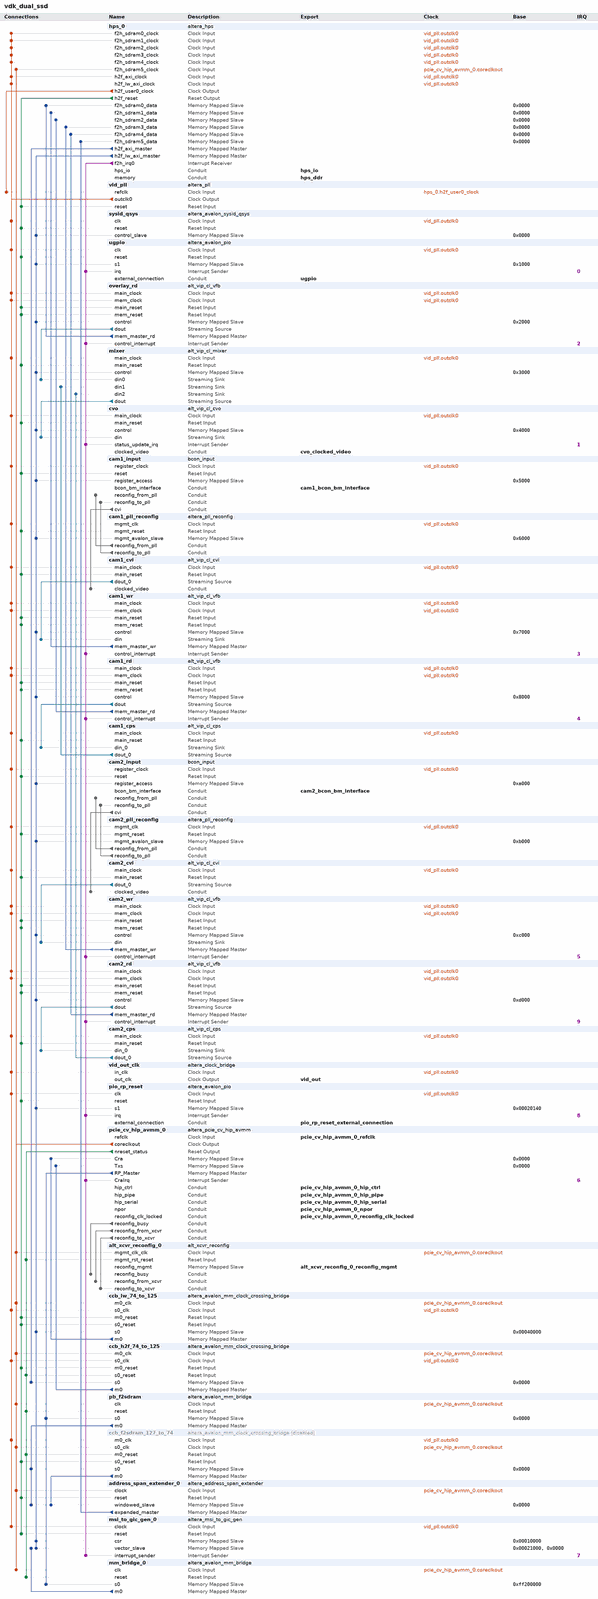
[diagram p0: system contents, whole]
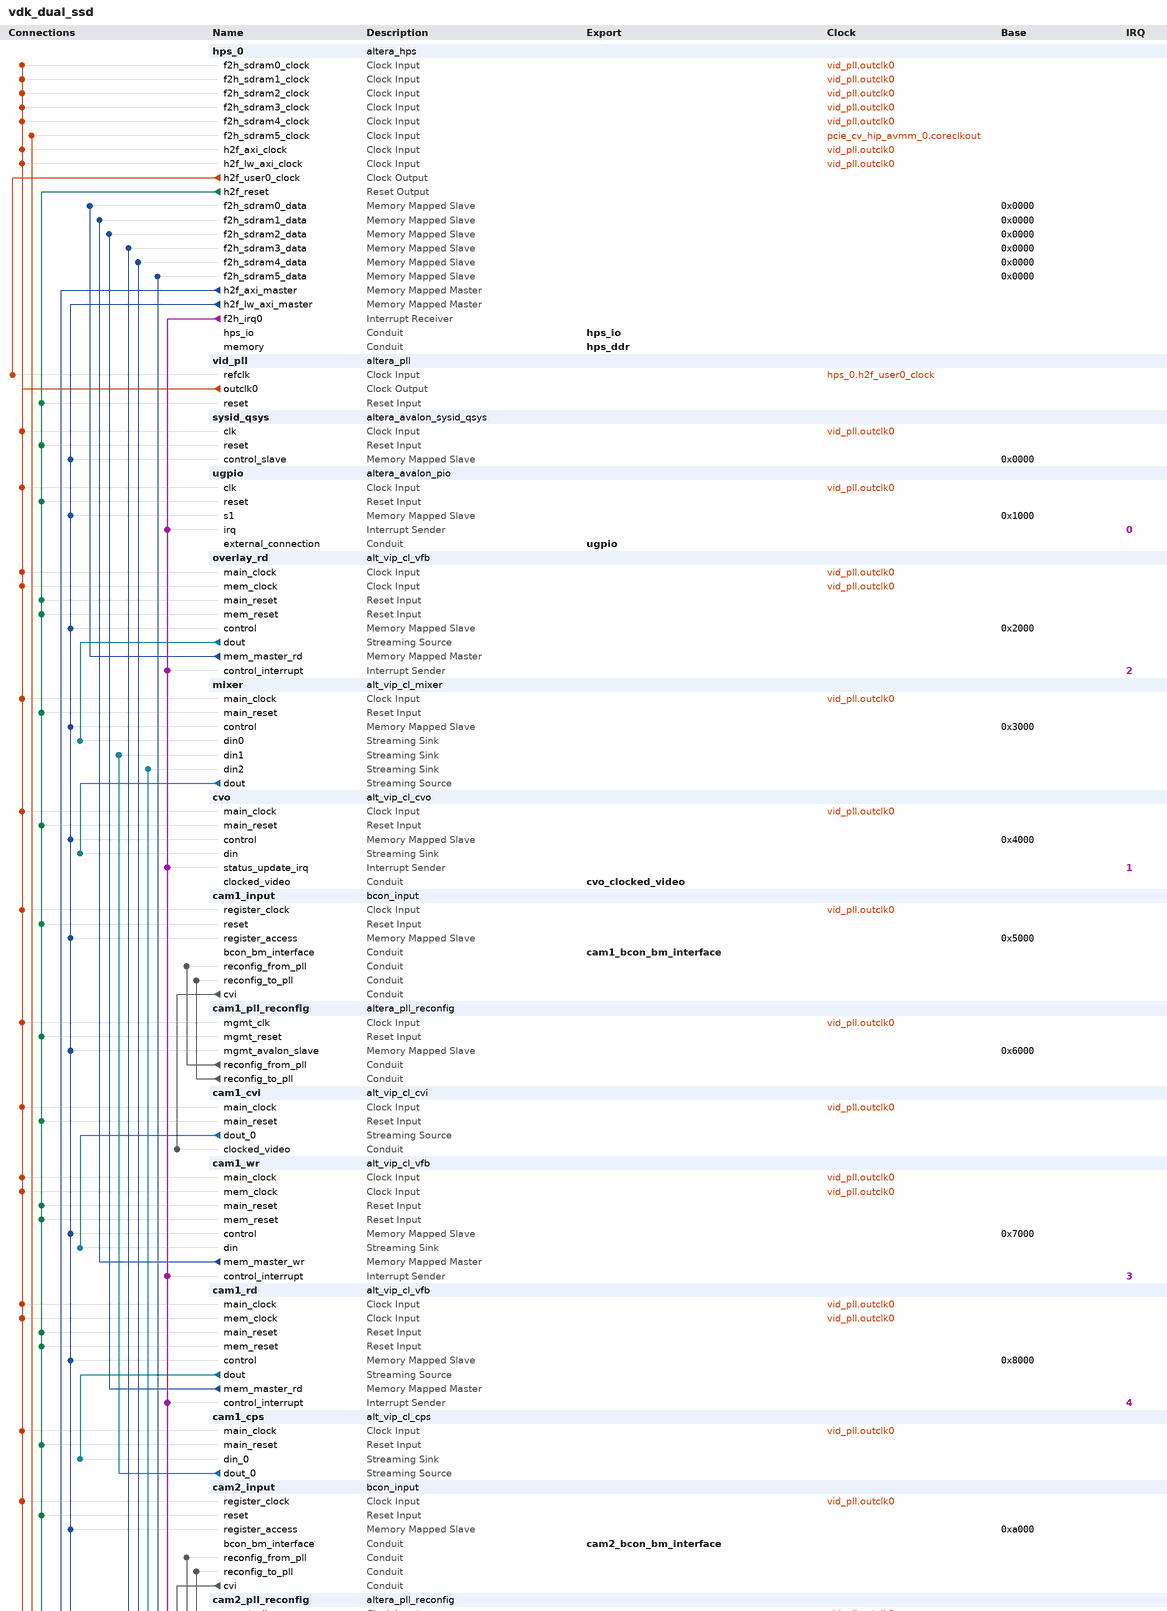
[diagram p1: system contents, upper part]
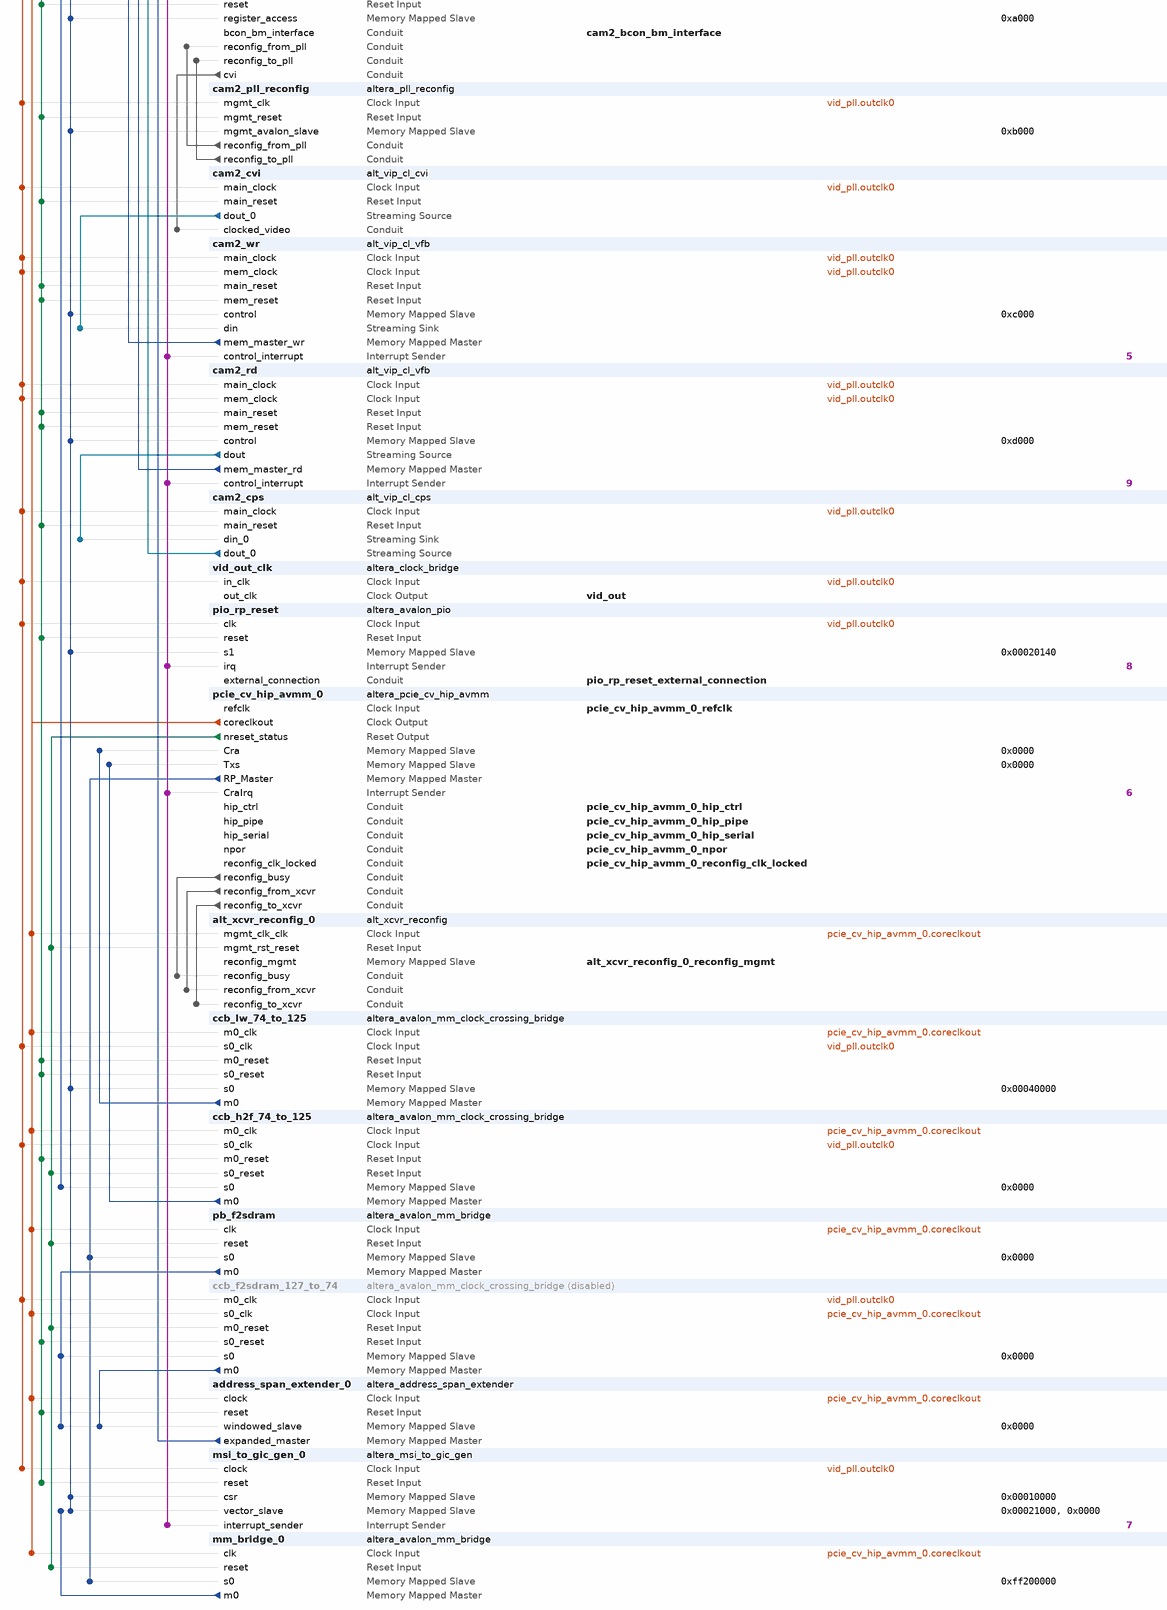
[diagram p2: system contents, lower part]
# Platform Designer (Qsys) system vdk_dual_ssd, Cyclone V 5CSXFC6C6U23C7
# Parameters at their usual value, and those the tool derives, are not listed.
package require -exact qsys 17.0
create_system vdk_dual_ssd
set_project_property DEVICE_FAMILY {Cyclone V}
set_project_property DEVICE 5CSXFC6C6U23C7

add_instance hps_0 altera_hps 17.0
set_instance_parameter_value hps_0 EMAC1_Mode RGMII
set_instance_parameter_value hps_0 EMAC1_PinMuxing {HPS I/O Set 0}
set_instance_parameter_value hps_0 F2SCLK_COLDRST_Enable false
set_instance_parameter_value hps_0 F2SCLK_DBGRST_Enable false
set_instance_parameter_value hps_0 F2SCLK_WARMRST_Enable false
set_instance_parameter_value hps_0 F2SDRAM_Type {Avalon-MM Read-Only,Avalon-MM Write-Only,Avalon-MM Read-Only,Avalon-MM Write-Only,Avalon-MM Read-Only,Avalon-MM Bidirectional}
set_instance_parameter_value hps_0 F2SDRAM_Width 64,64,64,64,64,64
set_instance_parameter_value hps_0 F2SINTERRUPT_Enable true
set_instance_parameter_value hps_0 F2S_Width 0
set_instance_parameter_value hps_0 FPGA_PERIPHERAL_OUTPUT_CLOCK_FREQ_EMAC0_GTX_CLK 100
set_instance_parameter_value hps_0 FPGA_PERIPHERAL_OUTPUT_CLOCK_FREQ_EMAC0_MD_CLK 100.0
set_instance_parameter_value hps_0 FPGA_PERIPHERAL_OUTPUT_CLOCK_FREQ_EMAC1_GTX_CLK 100
set_instance_parameter_value hps_0 FPGA_PERIPHERAL_OUTPUT_CLOCK_FREQ_EMAC1_MD_CLK 100.0
set_instance_parameter_value hps_0 HPS_PROTOCOL DDR3
set_instance_parameter_value hps_0 I2C0_Mode I2C
set_instance_parameter_value hps_0 I2C0_PinMuxing {HPS I/O Set 1}
set_instance_parameter_value hps_0 I2C1_Mode I2C
set_instance_parameter_value hps_0 I2C1_PinMuxing {HPS I/O Set 0}
set_instance_parameter_value hps_0 LWH2F_Enable true
set_instance_parameter_value hps_0 MEM_ASR Automatic
set_instance_parameter_value hps_0 MEM_BANKADDR_WIDTH 3
set_instance_parameter_value hps_0 MEM_CLK_FREQ 400.0
set_instance_parameter_value hps_0 MEM_COL_ADDR_WIDTH 10
set_instance_parameter_value hps_0 MEM_DQ_WIDTH 40
set_instance_parameter_value hps_0 MEM_DRV_STR RZQ/7
set_instance_parameter_value hps_0 MEM_ROW_ADDR_WIDTH 15
set_instance_parameter_value hps_0 MEM_RTT_NOM RZQ/4
set_instance_parameter_value hps_0 MEM_RTT_WR {Dynamic ODT off}
set_instance_parameter_value hps_0 MEM_TCL 7
set_instance_parameter_value hps_0 MEM_TFAW_NS 30.0
set_instance_parameter_value hps_0 MEM_TRAS_NS 35.0
set_instance_parameter_value hps_0 MEM_TRCD_NS 13.75
set_instance_parameter_value hps_0 MEM_TRFC_NS 260.0
set_instance_parameter_value hps_0 MEM_TRP_NS 13.75
set_instance_parameter_value hps_0 MEM_TRRD_NS 10.0
set_instance_parameter_value hps_0 MEM_TRTP_NS 10.0
set_instance_parameter_value hps_0 MEM_VENDOR JEDEC
set_instance_parameter_value hps_0 MEM_VOLTAGE {1.35V DDR3L}
set_instance_parameter_value hps_0 MEM_WTCL 6
set_instance_parameter_value hps_0 QSPI_Mode {2 SS}
set_instance_parameter_value hps_0 QSPI_PinMuxing {HPS I/O Set 1}
set_instance_parameter_value hps_0 REF_CLK_FREQ 25.0
set_instance_parameter_value hps_0 S2FCLK_USER0CLK_Enable true
set_instance_parameter_value hps_0 S2FCLK_USER2CLK 5
set_instance_parameter_value hps_0 S2F_Width 2
set_instance_parameter_value hps_0 SDIO_Mode {4-bit Data}
set_instance_parameter_value hps_0 SDIO_PinMuxing {HPS I/O Set 0}
set_instance_parameter_value hps_0 SPIM1_Mode N/A
set_instance_parameter_value hps_0 SPIM1_PinMuxing Unused
set_instance_parameter_value hps_0 STM_Enable false
set_instance_parameter_value hps_0 TIMING_BOARD_AC_SKEW 0.0
set_instance_parameter_value hps_0 TIMING_BOARD_AC_TO_CK_SKEW 0.0
set_instance_parameter_value hps_0 TIMING_BOARD_DQ_TO_DQS_SKEW 0.0
set_instance_parameter_value hps_0 TIMING_BOARD_MAX_CK_DELAY 0.6
set_instance_parameter_value hps_0 TIMING_BOARD_MAX_DQS_DELAY 0.2
set_instance_parameter_value hps_0 TIMING_BOARD_SKEW_BETWEEN_DQS 0.01
set_instance_parameter_value hps_0 TIMING_BOARD_SKEW_CKDQS_DIMM_MAX 0.215
set_instance_parameter_value hps_0 TIMING_BOARD_SKEW_CKDQS_DIMM_MIN 0.092
set_instance_parameter_value hps_0 TIMING_BOARD_SKEW_WITHIN_DQS 0.0
set_instance_parameter_value hps_0 TIMING_TDH 45
set_instance_parameter_value hps_0 TIMING_TDQSCK 225
set_instance_parameter_value hps_0 TIMING_TDQSQ 100
set_instance_parameter_value hps_0 TIMING_TDQSS 0.27
set_instance_parameter_value hps_0 TIMING_TDS 10
set_instance_parameter_value hps_0 TIMING_TDSH 0.18
set_instance_parameter_value hps_0 TIMING_TDSS 0.18
set_instance_parameter_value hps_0 TIMING_TIH 120
set_instance_parameter_value hps_0 TIMING_TIS 170
set_instance_parameter_value hps_0 TIMING_TQSH 0.4
set_instance_parameter_value hps_0 UART0_Mode {No Flow Control}
set_instance_parameter_value hps_0 UART0_PinMuxing {HPS I/O Set 2}
set_instance_parameter_value hps_0 USB1_Mode SDR
set_instance_parameter_value hps_0 USB1_PinMuxing {HPS I/O Set 0}
set_instance_parameter_value hps_0 desired_cfg_clk_mhz 100.0
set_instance_parameter_value hps_0 desired_qspi_clk_mhz 400.0

add_instance vid_pll altera_pll 17.0
set_instance_parameter_value vid_pll gui_device_speed_grade 2
set_instance_parameter_value vid_pll gui_number_of_clocks 1
set_instance_parameter_value vid_pll gui_operation_mode direct
set_instance_parameter_value vid_pll gui_output_clock_frequency0 74.25
set_instance_parameter_value vid_pll gui_pll_mode {Integer-N PLL}
set_instance_parameter_value vid_pll gui_reference_clock_frequency 100.0
set_instance_parameter_value vid_pll gui_use_locked false

add_instance sysid_qsys altera_avalon_sysid_qsys 17.0
set_instance_parameter_value sysid_qsys id 65536

add_instance ugpio altera_avalon_pio 17.0
set_instance_parameter_value ugpio bitClearingEdgeCapReg true
set_instance_parameter_value ugpio bitModifyingOutReg true
set_instance_parameter_value ugpio captureEdge true
set_instance_parameter_value ugpio direction Bidir
set_instance_parameter_value ugpio generateIRQ true
set_instance_parameter_value ugpio irqType EDGE
set_instance_parameter_value ugpio width 7

add_instance overlay_rd alt_vip_cl_vfb 17.0
set_instance_parameter_value overlay_rd CLOCKS_ARE_SEPARATE 1
set_instance_parameter_value overlay_rd DROP_FRAMES 1
set_instance_parameter_value overlay_rd DROP_INVALID_FIELDS 1
set_instance_parameter_value overlay_rd DROP_REPEAT_USER 0
set_instance_parameter_value overlay_rd IS_FRAME_READER 1
set_instance_parameter_value overlay_rd MAX_HEIGHT 720
set_instance_parameter_value overlay_rd MAX_WIDTH 1280
set_instance_parameter_value overlay_rd MEM_BASE_ADDR 536870912
set_instance_parameter_value overlay_rd MEM_BUFFER_OFFSET 16777216
set_instance_parameter_value overlay_rd MEM_PORT_WIDTH 64
set_instance_parameter_value overlay_rd READER_RUNTIME_CONTROL 1
set_instance_parameter_value overlay_rd READ_FIFO_DEPTH 64
set_instance_parameter_value overlay_rd USER_PACKETS_MAX_STORAGE 0
set_instance_parameter_value overlay_rd USE_BUFFER_OFFSET 0
set_instance_parameter_value overlay_rd WRITE_BURST_TARGET 32
set_instance_parameter_value overlay_rd WRITE_FIFO_DEPTH 64

add_instance mixer alt_vip_cl_mixer 17.0
set_instance_parameter_value mixer ALPHA_ENABLE 1
set_instance_parameter_value mixer ALPHA_STREAMS_ENABLE 0
set_instance_parameter_value mixer BITS_PER_SYMBOL 8
set_instance_parameter_value mixer COLOR_PLANES_ARE_IN_PARALLEL 1
set_instance_parameter_value mixer COLOR_SPACE RGB
set_instance_parameter_value mixer FAMILY {Cyclone V}
set_instance_parameter_value mixer IS_422 1
set_instance_parameter_value mixer LAYER_POSITION_ENABLE 1
set_instance_parameter_value mixer MAX_HEIGHT 720
set_instance_parameter_value mixer MAX_WIDTH 1280
set_instance_parameter_value mixer NO_OF_INPUTS 3
set_instance_parameter_value mixer NUMBER_OF_COLOR_PLANES 2
set_instance_parameter_value mixer PATTERN uniform
set_instance_parameter_value mixer PIPELINE_READY 0
set_instance_parameter_value mixer PIXELS_IN_PARALLEL 1
set_instance_parameter_value mixer UNIFORM_VALUE_BCR 0
set_instance_parameter_value mixer UNIFORM_VALUE_GCB 0
set_instance_parameter_value mixer UNIFORM_VALUE_RY 255
set_instance_parameter_value mixer USER_PACKET_FIFO_DEPTH 0
set_instance_parameter_value mixer USER_PACKET_SUPPORT DISCARD

add_instance cvo alt_vip_cl_cvo 17.0
set_instance_parameter_value cvo ACCEPT_COLOURS_IN_SEQ 0
set_instance_parameter_value cvo ANC_LINE 0
set_instance_parameter_value cvo AP_LINE 0
set_instance_parameter_value cvo BPS 8
set_instance_parameter_value cvo CLOCKS_ARE_SAME 1
set_instance_parameter_value cvo COLOUR_PLANES_ARE_IN_PARALLEL 1
set_instance_parameter_value cvo CONTEXT_WIDTH 8
set_instance_parameter_value cvo DST_WIDTH 8
set_instance_parameter_value cvo FIELD0_ANC_LINE 0
set_instance_parameter_value cvo FIELD0_V_BACK_PORCH 0
set_instance_parameter_value cvo FIELD0_V_BLANK 0
set_instance_parameter_value cvo FIELD0_V_FRONT_PORCH 0
set_instance_parameter_value cvo FIELD0_V_RISING_EDGE 0
set_instance_parameter_value cvo FIELD0_V_SYNC_LENGTH 0
set_instance_parameter_value cvo FIFO_DEPTH 1280
set_instance_parameter_value cvo F_FALLING_EDGE 0
set_instance_parameter_value cvo F_RISING_EDGE 0
set_instance_parameter_value cvo GENERATE_SYNC 0
set_instance_parameter_value cvo H_ACTIVE_PIXELS 1280
set_instance_parameter_value cvo H_BACK_PORCH 148
set_instance_parameter_value cvo H_BLANK 0
set_instance_parameter_value cvo H_FRONT_PORCH 88
set_instance_parameter_value cvo H_SYNC_LENGTH 44
set_instance_parameter_value cvo INTERLACED 0
set_instance_parameter_value cvo LOW_LATENCY 0
set_instance_parameter_value cvo NO_OF_CHANNELS 1
set_instance_parameter_value cvo NO_OF_MODES 1
set_instance_parameter_value cvo NUMBER_OF_COLOUR_PLANES 3
set_instance_parameter_value cvo PIXELS_IN_PARALLEL 1
set_instance_parameter_value cvo SRC_WIDTH 8
set_instance_parameter_value cvo STD_WIDTH 1
set_instance_parameter_value cvo TASK_WIDTH 8
set_instance_parameter_value cvo THRESHOLD 1279
set_instance_parameter_value cvo USE_CONTROL 1
set_instance_parameter_value cvo USE_EMBEDDED_SYNCS 0
set_instance_parameter_value cvo V_ACTIVE_LINES 720
set_instance_parameter_value cvo V_BACK_PORCH 36
set_instance_parameter_value cvo V_BLANK 0
set_instance_parameter_value cvo V_FRONT_PORCH 4
set_instance_parameter_value cvo V_SYNC_LENGTH 5

add_instance cam1_input bcon_input 1.1
set_instance_parameter_value cam1_input g_lane_invert 31
set_instance_parameter_value cam1_input g_vid_data_length 8

add_instance cam1_pll_reconfig altera_pll_reconfig 17.0

add_instance cam1_cvi alt_vip_cl_cvi 17.0
set_instance_parameter_value cam1_cvi ACCEPT_COLOURS_IN_SEQ 0
set_instance_parameter_value cam1_cvi ANC_DEPTH 1
set_instance_parameter_value cam1_cvi BPS 8
set_instance_parameter_value cam1_cvi CLOCKS_ARE_SAME 0
set_instance_parameter_value cam1_cvi COLOUR_PLANES_ARE_IN_PARALLEL 1
set_instance_parameter_value cam1_cvi EXTRACT_TOTAL_RESOLUTION 1
set_instance_parameter_value cam1_cvi FIFO_DEPTH 4096
set_instance_parameter_value cam1_cvi GENERATE_ANC 0
set_instance_parameter_value cam1_cvi GENERATE_VID_F 0
set_instance_parameter_value cam1_cvi H_ACTIVE_PIXELS_F0 2592
set_instance_parameter_value cam1_cvi INTERLACED 0
set_instance_parameter_value cam1_cvi MATCH_CTRLDATA_PKT_CLIP_BASIC 0
set_instance_parameter_value cam1_cvi MATCH_CTRLDATA_PKT_PAD_ADV 0
set_instance_parameter_value cam1_cvi NO_OF_CHANNELS 1
set_instance_parameter_value cam1_cvi NUMBER_OF_COLOUR_PLANES 1
set_instance_parameter_value cam1_cvi OVERFLOW_HANDLING 0
set_instance_parameter_value cam1_cvi PIXELS_IN_PARALLEL 1
set_instance_parameter_value cam1_cvi STD_WIDTH 1
set_instance_parameter_value cam1_cvi SYNC_TO 0
set_instance_parameter_value cam1_cvi USE_CONTROL 0
set_instance_parameter_value cam1_cvi USE_EMBEDDED_SYNCS 0
set_instance_parameter_value cam1_cvi USE_HDMI_DEPRICATION 0
set_instance_parameter_value cam1_cvi USE_STD 0
set_instance_parameter_value cam1_cvi V_ACTIVE_LINES_F0 1944
set_instance_parameter_value cam1_cvi V_ACTIVE_LINES_F1 480

add_instance cam1_wr alt_vip_cl_vfb 17.0
set_instance_parameter_value cam1_wr CLOCKS_ARE_SEPARATE 1
set_instance_parameter_value cam1_wr DROP_FRAMES 1
set_instance_parameter_value cam1_wr DROP_INVALID_FIELDS 1
set_instance_parameter_value cam1_wr DROP_REPEAT_USER 0
set_instance_parameter_value cam1_wr IS_FRAME_READER 0
set_instance_parameter_value cam1_wr IS_FRAME_WRITER 1
set_instance_parameter_value cam1_wr MAX_HEIGHT 1944
set_instance_parameter_value cam1_wr MAX_WIDTH 2592
set_instance_parameter_value cam1_wr MEM_BASE_ADDR 587202560
set_instance_parameter_value cam1_wr MEM_BUFFER_OFFSET 16777216
set_instance_parameter_value cam1_wr MEM_PORT_WIDTH 64
set_instance_parameter_value cam1_wr NUMBER_OF_COLOR_PLANES 1
set_instance_parameter_value cam1_wr READER_RUNTIME_CONTROL 0
set_instance_parameter_value cam1_wr READ_FIFO_DEPTH 64
set_instance_parameter_value cam1_wr USER_PACKETS_MAX_STORAGE 0
set_instance_parameter_value cam1_wr USE_BUFFER_OFFSET 0
set_instance_parameter_value cam1_wr WRITER_RUNTIME_CONTROL 1
set_instance_parameter_value cam1_wr WRITE_BURST_TARGET 32
set_instance_parameter_value cam1_wr WRITE_FIFO_DEPTH 64

add_instance cam1_rd alt_vip_cl_vfb 17.0
set_instance_parameter_value cam1_rd CLOCKS_ARE_SEPARATE 1
set_instance_parameter_value cam1_rd DROP_FRAMES 1
set_instance_parameter_value cam1_rd DROP_INVALID_FIELDS 1
set_instance_parameter_value cam1_rd DROP_REPEAT_USER 0
set_instance_parameter_value cam1_rd IS_FRAME_READER 1
set_instance_parameter_value cam1_rd MAX_HEIGHT 1944
set_instance_parameter_value cam1_rd MAX_WIDTH 2592
set_instance_parameter_value cam1_rd MEM_BASE_ADDR 587202560
set_instance_parameter_value cam1_rd MEM_BUFFER_OFFSET 16777216
set_instance_parameter_value cam1_rd MEM_PORT_WIDTH 64
set_instance_parameter_value cam1_rd NUMBER_OF_COLOR_PLANES 1
set_instance_parameter_value cam1_rd READER_RUNTIME_CONTROL 1
set_instance_parameter_value cam1_rd READ_FIFO_DEPTH 64
set_instance_parameter_value cam1_rd USER_PACKETS_MAX_STORAGE 0
set_instance_parameter_value cam1_rd USE_BUFFER_OFFSET 0
set_instance_parameter_value cam1_rd WRITE_BURST_TARGET 32
set_instance_parameter_value cam1_rd WRITE_FIFO_DEPTH 64

add_instance cam1_cps alt_vip_cl_cps 17.0
set_instance_parameter_value cam1_cps BITS_PER_SYMBOL 8
set_instance_parameter_value cam1_cps EXTRA_PIPELINING 0
set_instance_parameter_value cam1_cps INPUT_0_COLOR_PLANES_ARE_IN_PARALLEL 1
set_instance_parameter_value cam1_cps INPUT_0_FIFO 0
set_instance_parameter_value cam1_cps INPUT_0_FIFO_SIZE 8
set_instance_parameter_value cam1_cps INPUT_0_NUMBER_OF_COLOR_PLANES 1
set_instance_parameter_value cam1_cps INPUT_0_PATTERN C0
set_instance_parameter_value cam1_cps INPUT_0_PIXELS_IN_PARALLEL 1
set_instance_parameter_value cam1_cps INPUT_0_TWO_PIXELS_PATTERN 0
set_instance_parameter_value cam1_cps INPUT_1_COLOR_PLANES_ARE_IN_PARALLEL 1
set_instance_parameter_value cam1_cps INPUT_1_FIFO 0
set_instance_parameter_value cam1_cps INPUT_1_FIFO_SIZE 8
set_instance_parameter_value cam1_cps INPUT_1_NUMBER_OF_COLOR_PLANES 3
set_instance_parameter_value cam1_cps INPUT_1_PATTERN C0,C1,C2
set_instance_parameter_value cam1_cps INPUT_1_PIXELS_IN_PARALLEL 1
set_instance_parameter_value cam1_cps INPUT_1_TWO_PIXELS_PATTERN 0
set_instance_parameter_value cam1_cps INPUT_VALIDATION 1
set_instance_parameter_value cam1_cps NUMBER_OF_INPUTS 1
set_instance_parameter_value cam1_cps NUMBER_OF_OUTPUTS 1
set_instance_parameter_value cam1_cps OUTPUT_0_COLOR_PLANES_ARE_IN_PARALLEL 1
set_instance_parameter_value cam1_cps OUTPUT_0_FIFO 0
set_instance_parameter_value cam1_cps OUTPUT_0_FIFO_SIZE 8
set_instance_parameter_value cam1_cps OUTPUT_0_NUMBER_OF_COLOR_PLANES 3
set_instance_parameter_value cam1_cps OUTPUT_0_PATTERN C0,C0,C0
set_instance_parameter_value cam1_cps OUTPUT_0_PIXELS_IN_PARALLEL 1
set_instance_parameter_value cam1_cps OUTPUT_0_TWO_PIXELS_PATTERN 0
set_instance_parameter_value cam1_cps OUTPUT_1_COLOR_PLANES_ARE_IN_PARALLEL 1
set_instance_parameter_value cam1_cps OUTPUT_1_FIFO 0
set_instance_parameter_value cam1_cps OUTPUT_1_FIFO_SIZE 8
set_instance_parameter_value cam1_cps OUTPUT_1_NUMBER_OF_COLOR_PLANES 3
set_instance_parameter_value cam1_cps OUTPUT_1_PATTERN C0,C1,C2
set_instance_parameter_value cam1_cps OUTPUT_1_PIXELS_IN_PARALLEL 1
set_instance_parameter_value cam1_cps OUTPUT_1_TWO_PIXELS_PATTERN 0
set_instance_parameter_value cam1_cps OUTPUT_VALIDATION 1
set_instance_parameter_value cam1_cps USER_PACKET_SUPPORT PASSTHROUGH
set_instance_parameter_value cam1_cps USER_PKT_0_TO_0 1
set_instance_parameter_value cam1_cps USER_PKT_0_TO_1 0
set_instance_parameter_value cam1_cps USER_PKT_1_TO_0 0
set_instance_parameter_value cam1_cps USER_PKT_1_TO_1 1

add_instance cam2_input bcon_input 1.1
set_instance_parameter_value cam2_input g_lane_invert 31
set_instance_parameter_value cam2_input g_vid_data_length 8

add_instance cam2_pll_reconfig altera_pll_reconfig 17.0

add_instance cam2_cvi alt_vip_cl_cvi 17.0
set_instance_parameter_value cam2_cvi ACCEPT_COLOURS_IN_SEQ 0
set_instance_parameter_value cam2_cvi ANC_DEPTH 1
set_instance_parameter_value cam2_cvi BPS 8
set_instance_parameter_value cam2_cvi CLOCKS_ARE_SAME 0
set_instance_parameter_value cam2_cvi COLOUR_PLANES_ARE_IN_PARALLEL 1
set_instance_parameter_value cam2_cvi EXTRACT_TOTAL_RESOLUTION 1
set_instance_parameter_value cam2_cvi FIFO_DEPTH 4096
set_instance_parameter_value cam2_cvi GENERATE_ANC 0
set_instance_parameter_value cam2_cvi GENERATE_VID_F 0
set_instance_parameter_value cam2_cvi H_ACTIVE_PIXELS_F0 2592
set_instance_parameter_value cam2_cvi INTERLACED 0
set_instance_parameter_value cam2_cvi MATCH_CTRLDATA_PKT_CLIP_BASIC 0
set_instance_parameter_value cam2_cvi MATCH_CTRLDATA_PKT_PAD_ADV 0
set_instance_parameter_value cam2_cvi NO_OF_CHANNELS 1
set_instance_parameter_value cam2_cvi NUMBER_OF_COLOUR_PLANES 1
set_instance_parameter_value cam2_cvi OVERFLOW_HANDLING 0
set_instance_parameter_value cam2_cvi PIXELS_IN_PARALLEL 1
set_instance_parameter_value cam2_cvi STD_WIDTH 1
set_instance_parameter_value cam2_cvi SYNC_TO 0
set_instance_parameter_value cam2_cvi USE_CONTROL 0
set_instance_parameter_value cam2_cvi USE_EMBEDDED_SYNCS 0
set_instance_parameter_value cam2_cvi USE_HDMI_DEPRICATION 0
set_instance_parameter_value cam2_cvi USE_STD 0
set_instance_parameter_value cam2_cvi V_ACTIVE_LINES_F0 1944
set_instance_parameter_value cam2_cvi V_ACTIVE_LINES_F1 480

add_instance cam2_wr alt_vip_cl_vfb 17.0
set_instance_parameter_value cam2_wr CLOCKS_ARE_SEPARATE 1
set_instance_parameter_value cam2_wr DROP_FRAMES 1
set_instance_parameter_value cam2_wr DROP_INVALID_FIELDS 1
set_instance_parameter_value cam2_wr DROP_REPEAT_USER 0
set_instance_parameter_value cam2_wr IS_FRAME_READER 0
set_instance_parameter_value cam2_wr IS_FRAME_WRITER 1
set_instance_parameter_value cam2_wr MAX_HEIGHT 1944
set_instance_parameter_value cam2_wr MAX_WIDTH 2592
set_instance_parameter_value cam2_wr MEM_BASE_ADDR 637534208
set_instance_parameter_value cam2_wr MEM_BUFFER_OFFSET 16777216
set_instance_parameter_value cam2_wr MEM_PORT_WIDTH 64
set_instance_parameter_value cam2_wr NUMBER_OF_COLOR_PLANES 1
set_instance_parameter_value cam2_wr READER_RUNTIME_CONTROL 0
set_instance_parameter_value cam2_wr READ_FIFO_DEPTH 64
set_instance_parameter_value cam2_wr USER_PACKETS_MAX_STORAGE 0
set_instance_parameter_value cam2_wr USE_BUFFER_OFFSET 0
set_instance_parameter_value cam2_wr WRITER_RUNTIME_CONTROL 1
set_instance_parameter_value cam2_wr WRITE_BURST_TARGET 32
set_instance_parameter_value cam2_wr WRITE_FIFO_DEPTH 64

add_instance cam2_rd alt_vip_cl_vfb 17.0
set_instance_parameter_value cam2_rd CLOCKS_ARE_SEPARATE 1
set_instance_parameter_value cam2_rd DROP_FRAMES 1
set_instance_parameter_value cam2_rd DROP_INVALID_FIELDS 1
set_instance_parameter_value cam2_rd DROP_REPEAT_USER 0
set_instance_parameter_value cam2_rd IS_FRAME_READER 1
set_instance_parameter_value cam2_rd MAX_HEIGHT 1944
set_instance_parameter_value cam2_rd MAX_WIDTH 2592
set_instance_parameter_value cam2_rd MEM_BASE_ADDR 637534208
set_instance_parameter_value cam2_rd MEM_BUFFER_OFFSET 16777216
set_instance_parameter_value cam2_rd MEM_PORT_WIDTH 64
set_instance_parameter_value cam2_rd NUMBER_OF_COLOR_PLANES 1
set_instance_parameter_value cam2_rd READER_RUNTIME_CONTROL 1
set_instance_parameter_value cam2_rd READ_FIFO_DEPTH 64
set_instance_parameter_value cam2_rd USER_PACKETS_MAX_STORAGE 0
set_instance_parameter_value cam2_rd USE_BUFFER_OFFSET 0
set_instance_parameter_value cam2_rd WRITE_BURST_TARGET 32
set_instance_parameter_value cam2_rd WRITE_FIFO_DEPTH 64

add_instance cam2_cps alt_vip_cl_cps 17.0
set_instance_parameter_value cam2_cps BITS_PER_SYMBOL 8
set_instance_parameter_value cam2_cps EXTRA_PIPELINING 0
set_instance_parameter_value cam2_cps INPUT_0_COLOR_PLANES_ARE_IN_PARALLEL 1
set_instance_parameter_value cam2_cps INPUT_0_FIFO 0
set_instance_parameter_value cam2_cps INPUT_0_FIFO_SIZE 8
set_instance_parameter_value cam2_cps INPUT_0_NUMBER_OF_COLOR_PLANES 1
set_instance_parameter_value cam2_cps INPUT_0_PATTERN C0
set_instance_parameter_value cam2_cps INPUT_0_PIXELS_IN_PARALLEL 1
set_instance_parameter_value cam2_cps INPUT_0_TWO_PIXELS_PATTERN 0
set_instance_parameter_value cam2_cps INPUT_1_COLOR_PLANES_ARE_IN_PARALLEL 1
set_instance_parameter_value cam2_cps INPUT_1_FIFO 0
set_instance_parameter_value cam2_cps INPUT_1_FIFO_SIZE 8
set_instance_parameter_value cam2_cps INPUT_1_NUMBER_OF_COLOR_PLANES 3
set_instance_parameter_value cam2_cps INPUT_1_PATTERN C0,C1,C2
set_instance_parameter_value cam2_cps INPUT_1_PIXELS_IN_PARALLEL 1
set_instance_parameter_value cam2_cps INPUT_1_TWO_PIXELS_PATTERN 0
set_instance_parameter_value cam2_cps INPUT_VALIDATION 1
set_instance_parameter_value cam2_cps NUMBER_OF_INPUTS 1
set_instance_parameter_value cam2_cps NUMBER_OF_OUTPUTS 1
set_instance_parameter_value cam2_cps OUTPUT_0_COLOR_PLANES_ARE_IN_PARALLEL 1
set_instance_parameter_value cam2_cps OUTPUT_0_FIFO 0
set_instance_parameter_value cam2_cps OUTPUT_0_FIFO_SIZE 8
set_instance_parameter_value cam2_cps OUTPUT_0_NUMBER_OF_COLOR_PLANES 3
set_instance_parameter_value cam2_cps OUTPUT_0_PATTERN C0,C0,C0
set_instance_parameter_value cam2_cps OUTPUT_0_PIXELS_IN_PARALLEL 1
set_instance_parameter_value cam2_cps OUTPUT_0_TWO_PIXELS_PATTERN 0
set_instance_parameter_value cam2_cps OUTPUT_1_COLOR_PLANES_ARE_IN_PARALLEL 1
set_instance_parameter_value cam2_cps OUTPUT_1_FIFO 0
set_instance_parameter_value cam2_cps OUTPUT_1_FIFO_SIZE 8
set_instance_parameter_value cam2_cps OUTPUT_1_NUMBER_OF_COLOR_PLANES 3
set_instance_parameter_value cam2_cps OUTPUT_1_PATTERN C0,C1,C2
set_instance_parameter_value cam2_cps OUTPUT_1_PIXELS_IN_PARALLEL 1
set_instance_parameter_value cam2_cps OUTPUT_1_TWO_PIXELS_PATTERN 0
set_instance_parameter_value cam2_cps OUTPUT_VALIDATION 1
set_instance_parameter_value cam2_cps USER_PACKET_SUPPORT PASSTHROUGH
set_instance_parameter_value cam2_cps USER_PKT_0_TO_0 0
set_instance_parameter_value cam2_cps USER_PKT_0_TO_1 0
set_instance_parameter_value cam2_cps USER_PKT_1_TO_0 0
set_instance_parameter_value cam2_cps USER_PKT_1_TO_1 1

add_instance vid_out_clk altera_clock_bridge 17.0
set_instance_parameter_value vid_out_clk DERIVED_CLOCK_RATE 74242424
set_instance_parameter_value vid_out_clk EXPLICIT_CLOCK_RATE 0

add_instance pio_rp_reset altera_avalon_pio 17.0
set_instance_parameter_value pio_rp_reset bitClearingEdgeCapReg true
set_instance_parameter_value pio_rp_reset bitModifyingOutReg true
set_instance_parameter_value pio_rp_reset captureEdge true
set_instance_parameter_value pio_rp_reset direction InOut
set_instance_parameter_value pio_rp_reset generateIRQ true
set_instance_parameter_value pio_rp_reset irqType EDGE
set_instance_parameter_value pio_rp_reset width 1

add_instance pcie_cv_hip_avmm_0 altera_pcie_cv_hip_avmm 17.0
set_instance_parameter_value pcie_cv_hip_avmm_0 AST_LITE 0
set_instance_parameter_value pcie_cv_hip_avmm_0 AVALON_ADDR_WIDTH 32
set_instance_parameter_value pcie_cv_hip_avmm_0 AddressPage "0\\,1\\,2\\,3\\,4\\,5\\,6\\,7\\,8\\,9\\,10\\,11\\,12\\,13\\,14\\,15"
set_instance_parameter_value pcie_cv_hip_avmm_0 BYPASSS_A2P_TRANSLATION 0
set_instance_parameter_value pcie_cv_hip_avmm_0 CB_A2P_ADDR_MAP_FIXED_TABLE_0_HIGH 0
set_instance_parameter_value pcie_cv_hip_avmm_0 CB_A2P_ADDR_MAP_FIXED_TABLE_0_LOW 0
set_instance_parameter_value pcie_cv_hip_avmm_0 CB_A2P_ADDR_MAP_FIXED_TABLE_10_HIGH 0
set_instance_parameter_value pcie_cv_hip_avmm_0 CB_A2P_ADDR_MAP_FIXED_TABLE_10_LOW 0
set_instance_parameter_value pcie_cv_hip_avmm_0 CB_A2P_ADDR_MAP_FIXED_TABLE_11_HIGH 0
set_instance_parameter_value pcie_cv_hip_avmm_0 CB_A2P_ADDR_MAP_FIXED_TABLE_11_LOW 0
set_instance_parameter_value pcie_cv_hip_avmm_0 CB_A2P_ADDR_MAP_FIXED_TABLE_12_HIGH 0
set_instance_parameter_value pcie_cv_hip_avmm_0 CB_A2P_ADDR_MAP_FIXED_TABLE_12_LOW 0
set_instance_parameter_value pcie_cv_hip_avmm_0 CB_A2P_ADDR_MAP_FIXED_TABLE_13_HIGH 0
set_instance_parameter_value pcie_cv_hip_avmm_0 CB_A2P_ADDR_MAP_FIXED_TABLE_13_LOW 0
set_instance_parameter_value pcie_cv_hip_avmm_0 CB_A2P_ADDR_MAP_FIXED_TABLE_14_HIGH 0
set_instance_parameter_value pcie_cv_hip_avmm_0 CB_A2P_ADDR_MAP_FIXED_TABLE_14_LOW 0
set_instance_parameter_value pcie_cv_hip_avmm_0 CB_A2P_ADDR_MAP_FIXED_TABLE_15_HIGH 0
set_instance_parameter_value pcie_cv_hip_avmm_0 CB_A2P_ADDR_MAP_FIXED_TABLE_15_LOW 0
set_instance_parameter_value pcie_cv_hip_avmm_0 CB_A2P_ADDR_MAP_FIXED_TABLE_1_HIGH 0
set_instance_parameter_value pcie_cv_hip_avmm_0 CB_A2P_ADDR_MAP_FIXED_TABLE_1_LOW 0
set_instance_parameter_value pcie_cv_hip_avmm_0 CB_A2P_ADDR_MAP_FIXED_TABLE_2_HIGH 0
set_instance_parameter_value pcie_cv_hip_avmm_0 CB_A2P_ADDR_MAP_FIXED_TABLE_2_LOW 0
set_instance_parameter_value pcie_cv_hip_avmm_0 CB_A2P_ADDR_MAP_FIXED_TABLE_3_HIGH 0
set_instance_parameter_value pcie_cv_hip_avmm_0 CB_A2P_ADDR_MAP_FIXED_TABLE_3_LOW 0
set_instance_parameter_value pcie_cv_hip_avmm_0 CB_A2P_ADDR_MAP_FIXED_TABLE_4_HIGH 0
set_instance_parameter_value pcie_cv_hip_avmm_0 CB_A2P_ADDR_MAP_FIXED_TABLE_4_LOW 0
set_instance_parameter_value pcie_cv_hip_avmm_0 CB_A2P_ADDR_MAP_FIXED_TABLE_5_HIGH 0
set_instance_parameter_value pcie_cv_hip_avmm_0 CB_A2P_ADDR_MAP_FIXED_TABLE_5_LOW 0
set_instance_parameter_value pcie_cv_hip_avmm_0 CB_A2P_ADDR_MAP_FIXED_TABLE_6_HIGH 0
set_instance_parameter_value pcie_cv_hip_avmm_0 CB_A2P_ADDR_MAP_FIXED_TABLE_6_LOW 0
set_instance_parameter_value pcie_cv_hip_avmm_0 CB_A2P_ADDR_MAP_FIXED_TABLE_7_HIGH 0
set_instance_parameter_value pcie_cv_hip_avmm_0 CB_A2P_ADDR_MAP_FIXED_TABLE_7_LOW 0
set_instance_parameter_value pcie_cv_hip_avmm_0 CB_A2P_ADDR_MAP_FIXED_TABLE_8_HIGH 0
set_instance_parameter_value pcie_cv_hip_avmm_0 CB_A2P_ADDR_MAP_FIXED_TABLE_8_LOW 0
set_instance_parameter_value pcie_cv_hip_avmm_0 CB_A2P_ADDR_MAP_FIXED_TABLE_9_HIGH 0
set_instance_parameter_value pcie_cv_hip_avmm_0 CB_A2P_ADDR_MAP_FIXED_TABLE_9_LOW 0
set_instance_parameter_value pcie_cv_hip_avmm_0 CB_A2P_ADDR_MAP_IS_FIXED 0
set_instance_parameter_value pcie_cv_hip_avmm_0 CB_A2P_ADDR_MAP_NUM_ENTRIES 2
set_instance_parameter_value pcie_cv_hip_avmm_0 CB_A2P_ADDR_MAP_PASS_THRU_BITS 28
set_instance_parameter_value pcie_cv_hip_avmm_0 CB_P2A_AVALON_ADDR_B0 0x00000000
set_instance_parameter_value pcie_cv_hip_avmm_0 CB_P2A_AVALON_ADDR_B1 0x00000000
set_instance_parameter_value pcie_cv_hip_avmm_0 CB_P2A_AVALON_ADDR_B2 0x00000000
set_instance_parameter_value pcie_cv_hip_avmm_0 CB_P2A_AVALON_ADDR_B3 0x00000000
set_instance_parameter_value pcie_cv_hip_avmm_0 CB_P2A_AVALON_ADDR_B4 0x00000000
set_instance_parameter_value pcie_cv_hip_avmm_0 CB_P2A_AVALON_ADDR_B5 0x00000000
set_instance_parameter_value pcie_cv_hip_avmm_0 CB_P2A_FIXED_AVALON_ADDR_B0 0
set_instance_parameter_value pcie_cv_hip_avmm_0 CB_P2A_FIXED_AVALON_ADDR_B1 0
set_instance_parameter_value pcie_cv_hip_avmm_0 CB_P2A_FIXED_AVALON_ADDR_B2 0
set_instance_parameter_value pcie_cv_hip_avmm_0 CB_P2A_FIXED_AVALON_ADDR_B3 0
set_instance_parameter_value pcie_cv_hip_avmm_0 CB_P2A_FIXED_AVALON_ADDR_B4 0
set_instance_parameter_value pcie_cv_hip_avmm_0 CB_P2A_FIXED_AVALON_ADDR_B5 0
set_instance_parameter_value pcie_cv_hip_avmm_0 CB_PCIE_MODE 0
set_instance_parameter_value pcie_cv_hip_avmm_0 CB_PCIE_RX_LITE 0
set_instance_parameter_value pcie_cv_hip_avmm_0 CB_RP_S_ADDR_WIDTH 32
set_instance_parameter_value pcie_cv_hip_avmm_0 CG_COMMON_CLOCK_MODE 1
set_instance_parameter_value pcie_cv_hip_avmm_0 CG_ENABLE_A2P_INTERRUPT 0
set_instance_parameter_value pcie_cv_hip_avmm_0 CG_ENABLE_ADVANCED_INTERRUPT 0
set_instance_parameter_value pcie_cv_hip_avmm_0 CG_ENABLE_HIP_STATUS 0
set_instance_parameter_value pcie_cv_hip_avmm_0 CG_ENABLE_HIP_STATUS_EXTENSION 0
set_instance_parameter_value pcie_cv_hip_avmm_0 CG_IMPL_CRA_AV_SLAVE_PORT 1
set_instance_parameter_value pcie_cv_hip_avmm_0 CG_RXM_IRQ_NUM 16
set_instance_parameter_value pcie_cv_hip_avmm_0 NUM_PREFETCH_MASTERS 1
set_instance_parameter_value pcie_cv_hip_avmm_0 PCIeAddress31_0 "0x00000000\\,0x00000000\\,0x00000000\\,0x00000000\\,0x00000000\\,0x00000000\\,0x00000000\\,0x00000000\\,0x00000000\\,0x00000000\\,0x00000000\\,0x00000000\\,0x00000000\\,0x00000000\\,0x00000000\\,0x00000000"
set_instance_parameter_value pcie_cv_hip_avmm_0 PCIeAddress63_32 "0x00000000\\,0x00000000\\,0x00000000\\,0x00000000\\,0x00000000\\,0x00000000\\,0x00000000\\,0x00000000\\,0x00000000\\,0x00000000\\,0x00000000\\,0x00000000\\,0x00000000\\,0x00000000\\,0x00000000\\,0x00000000"
set_instance_parameter_value pcie_cv_hip_avmm_0 RXM_BEN_WIDTH 8
set_instance_parameter_value pcie_cv_hip_avmm_0 RXM_DATA_WIDTH 64
set_instance_parameter_value pcie_cv_hip_avmm_0 SLAVE_ADDRESS_MAP_0 0
set_instance_parameter_value pcie_cv_hip_avmm_0 SLAVE_ADDRESS_MAP_1 0
set_instance_parameter_value pcie_cv_hip_avmm_0 SLAVE_ADDRESS_MAP_2 0
set_instance_parameter_value pcie_cv_hip_avmm_0 SLAVE_ADDRESS_MAP_3 0
set_instance_parameter_value pcie_cv_hip_avmm_0 SLAVE_ADDRESS_MAP_4 0
set_instance_parameter_value pcie_cv_hip_avmm_0 SLAVE_ADDRESS_MAP_5 0
set_instance_parameter_value pcie_cv_hip_avmm_0 TX_S_ADDR_WIDTH 32
set_instance_parameter_value pcie_cv_hip_avmm_0 advanced_default_parameter_override 0
set_instance_parameter_value pcie_cv_hip_avmm_0 altpcie_avmm_hwtcl 1
set_instance_parameter_value pcie_cv_hip_avmm_0 atomic_malformed_hwtcl true
set_instance_parameter_value pcie_cv_hip_avmm_0 atomic_op_completer_32bit_hwtcl false
set_instance_parameter_value pcie_cv_hip_avmm_0 atomic_op_completer_64bit_hwtcl false
set_instance_parameter_value pcie_cv_hip_avmm_0 atomic_op_routing_hwtcl false
set_instance_parameter_value pcie_cv_hip_avmm_0 avmm_width_hwtcl 64
set_instance_parameter_value pcie_cv_hip_avmm_0 bar0_type_hwtcl 0
set_instance_parameter_value pcie_cv_hip_avmm_0 bar1_type_hwtcl 0
set_instance_parameter_value pcie_cv_hip_avmm_0 bar2_type_hwtcl 0
set_instance_parameter_value pcie_cv_hip_avmm_0 bar3_type_hwtcl 0
set_instance_parameter_value pcie_cv_hip_avmm_0 bar4_type_hwtcl 0
set_instance_parameter_value pcie_cv_hip_avmm_0 bar5_type_hwtcl 0
set_instance_parameter_value pcie_cv_hip_avmm_0 bridge_port_ssid_support_hwtcl false
set_instance_parameter_value pcie_cv_hip_avmm_0 bridge_port_vga_enable_hwtcl false
set_instance_parameter_value pcie_cv_hip_avmm_0 bypass_cdc_hwtcl false
set_instance_parameter_value pcie_cv_hip_avmm_0 bypass_tl false
set_instance_parameter_value pcie_cv_hip_avmm_0 cas_completer_128bit_hwtcl false
set_instance_parameter_value pcie_cv_hip_avmm_0 cdc_dummy_insert_limit_advanced_default_hwtcl 11
set_instance_parameter_value pcie_cv_hip_avmm_0 class_code_hwtcl 394240
set_instance_parameter_value pcie_cv_hip_avmm_0 completion_timeout_hwtcl ABCD
set_instance_parameter_value pcie_cv_hip_avmm_0 coreclkout_hip_phaseshift_hwtcl {0 ps}
set_instance_parameter_value pcie_cv_hip_avmm_0 d0_pme_advanced_default_hwtcl false
set_instance_parameter_value pcie_cv_hip_avmm_0 d1_pme_advanced_default_hwtcl false
set_instance_parameter_value pcie_cv_hip_avmm_0 d1_support_advanced_default_hwtcl false
set_instance_parameter_value pcie_cv_hip_avmm_0 d2_pme_advanced_default_hwtcl false
set_instance_parameter_value pcie_cv_hip_avmm_0 d2_support_advanced_default_hwtcl false
set_instance_parameter_value pcie_cv_hip_avmm_0 d3_cold_pme_advanced_default_hwtcl false
set_instance_parameter_value pcie_cv_hip_avmm_0 d3_hot_pme_advanced_default_hwtcl false
set_instance_parameter_value pcie_cv_hip_avmm_0 data_pack_rx_hwtcl disable
set_instance_parameter_value pcie_cv_hip_avmm_0 deemphasis_enable_advanced_default_hwtcl false
set_instance_parameter_value pcie_cv_hip_avmm_0 deskew_comma_hwtcl skp_eieos_deskw
set_instance_parameter_value pcie_cv_hip_avmm_0 device_id_hwtcl 57344
set_instance_parameter_value pcie_cv_hip_avmm_0 device_number_advanced_default_hwtcl 0
set_instance_parameter_value pcie_cv_hip_avmm_0 diffclock_nfts_count_advanced_default_hwtcl 255
set_instance_parameter_value pcie_cv_hip_avmm_0 disable_link_x2_support_advanced_default_hwtcl false
set_instance_parameter_value pcie_cv_hip_avmm_0 disable_snoop_packet_hwtcl false
set_instance_parameter_value pcie_cv_hip_avmm_0 dll_active_report_support_hwtcl 0
set_instance_parameter_value pcie_cv_hip_avmm_0 ecrc_check_capable_hwtcl 0
set_instance_parameter_value pcie_cv_hip_avmm_0 ecrc_gen_capable_hwtcl 0
set_instance_parameter_value pcie_cv_hip_avmm_0 ei_delay_powerdown_count_advanced_default_hwtcl 10
set_instance_parameter_value pcie_cv_hip_avmm_0 eie_before_nfts_count_advanced_default_hwtcl 4
set_instance_parameter_value pcie_cv_hip_avmm_0 enable_completion_timeout_disable_hwtcl 1
set_instance_parameter_value pcie_cv_hip_avmm_0 enable_function_msix_support_hwtcl 0
set_instance_parameter_value pcie_cv_hip_avmm_0 enable_l0s_aspm_hwtcl true
set_instance_parameter_value pcie_cv_hip_avmm_0 enable_l1_aspm_advanced_default_hwtcl false
set_instance_parameter_value pcie_cv_hip_avmm_0 enable_rx_buffer_checking_advanced_default_hwtcl false
set_instance_parameter_value pcie_cv_hip_avmm_0 enable_slot_register_hwtcl 0
set_instance_parameter_value pcie_cv_hip_avmm_0 endpoint_l0_latency_hwtcl 0
set_instance_parameter_value pcie_cv_hip_avmm_0 endpoint_l1_latency_hwtcl 0
set_instance_parameter_value pcie_cv_hip_avmm_0 expansion_base_address_register_hwtcl 0
set_instance_parameter_value pcie_cv_hip_avmm_0 extend_tag_field_hwtcl 32
set_instance_parameter_value pcie_cv_hip_avmm_0 extended_format_field_hwtcl true
set_instance_parameter_value pcie_cv_hip_avmm_0 extended_tag_reset_hwtcl false
set_instance_parameter_value pcie_cv_hip_avmm_0 fc_init_timer_advanced_default_hwtcl 1024
set_instance_parameter_value pcie_cv_hip_avmm_0 fixed_address_mode 0
set_instance_parameter_value pcie_cv_hip_avmm_0 flow_control_timeout_count_advanced_default_hwtcl 200
set_instance_parameter_value pcie_cv_hip_avmm_0 flow_control_update_count_advanced_default_hwtcl 30
set_instance_parameter_value pcie_cv_hip_avmm_0 flr_capability_hwtcl 0
set_instance_parameter_value pcie_cv_hip_avmm_0 force_hrc 0
set_instance_parameter_value pcie_cv_hip_avmm_0 force_src 0
set_instance_parameter_value pcie_cv_hip_avmm_0 gen123_lane_rate_mode_hwtcl {Gen1 (2.5 Gbps)}
set_instance_parameter_value pcie_cv_hip_avmm_0 gen2_diffclock_nfts_count_advanced_default_hwtcl 255
set_instance_parameter_value pcie_cv_hip_avmm_0 gen2_sameclock_nfts_count_advanced_default_hwtcl 255
set_instance_parameter_value pcie_cv_hip_avmm_0 gen3_rxfreqlock_counter_hwtcl 0
set_instance_parameter_value pcie_cv_hip_avmm_0 hip_reconfig_hwtcl 0
set_instance_parameter_value pcie_cv_hip_avmm_0 hot_plug_support_advanced_default_hwtcl 0
set_instance_parameter_value pcie_cv_hip_avmm_0 in_cvp_mode_hwtcl 0
set_instance_parameter_value pcie_cv_hip_avmm_0 indicator_advanced_default_hwtcl 0
set_instance_parameter_value pcie_cv_hip_avmm_0 interrupt_pin_hwtcl inta
set_instance_parameter_value pcie_cv_hip_avmm_0 io_window_addr_width_hwtcl 0
set_instance_parameter_value pcie_cv_hip_avmm_0 l01_entry_latency_advanced_default_hwtcl 31
set_instance_parameter_value pcie_cv_hip_avmm_0 l0_exit_latency_diffclock_advanced_default_hwtcl 6
set_instance_parameter_value pcie_cv_hip_avmm_0 l0_exit_latency_sameclock_advanced_default_hwtcl 6
set_instance_parameter_value pcie_cv_hip_avmm_0 l1_exit_latency_diffclock_advanced_default_hwtcl 0
set_instance_parameter_value pcie_cv_hip_avmm_0 l1_exit_latency_sameclock_advanced_default_hwtcl 0
set_instance_parameter_value pcie_cv_hip_avmm_0 l2_async_logic_advanced_default_hwtcl disable
set_instance_parameter_value pcie_cv_hip_avmm_0 lane_mask_hwtcl x4
set_instance_parameter_value pcie_cv_hip_avmm_0 low_priority_vc_advanced_default_hwtcl single_vc
set_instance_parameter_value pcie_cv_hip_avmm_0 ltr_mechanism_hwtcl false
set_instance_parameter_value pcie_cv_hip_avmm_0 ltssm_1ms_timeout_hwtcl disable
set_instance_parameter_value pcie_cv_hip_avmm_0 ltssm_freqlocked_check_hwtcl disable
set_instance_parameter_value pcie_cv_hip_avmm_0 max_payload_size_hwtcl 256
set_instance_parameter_value pcie_cv_hip_avmm_0 maximum_current_hwtcl 0
set_instance_parameter_value pcie_cv_hip_avmm_0 msi_64bit_addressing_capable_hwtcl true
set_instance_parameter_value pcie_cv_hip_avmm_0 msi_masking_capable_hwtcl false
set_instance_parameter_value pcie_cv_hip_avmm_0 msi_multi_message_capable_hwtcl 4
set_instance_parameter_value pcie_cv_hip_avmm_0 msi_support_hwtcl true
set_instance_parameter_value pcie_cv_hip_avmm_0 msix_pba_bir_hwtcl 0
set_instance_parameter_value pcie_cv_hip_avmm_0 msix_pba_offset_hwtcl 0
set_instance_parameter_value pcie_cv_hip_avmm_0 msix_table_bir_hwtcl 0
set_instance_parameter_value pcie_cv_hip_avmm_0 msix_table_offset_hwtcl 0
set_instance_parameter_value pcie_cv_hip_avmm_0 msix_table_size_hwtcl 0
set_instance_parameter_value pcie_cv_hip_avmm_0 no_command_completed_advanced_default_hwtcl false
set_instance_parameter_value pcie_cv_hip_avmm_0 no_soft_reset_advanced_default_hwtcl false
set_instance_parameter_value pcie_cv_hip_avmm_0 override_rxbuffer_cred_preset 0
set_instance_parameter_value pcie_cv_hip_avmm_0 override_tbpartner_driver_setting_hwtcl 0
set_instance_parameter_value pcie_cv_hip_avmm_0 pcie_qsys 1
set_instance_parameter_value pcie_cv_hip_avmm_0 pclk_out_sel_advanced_default_hwtcl pclk
set_instance_parameter_value pcie_cv_hip_avmm_0 pipex1_debug_sel_advanced_default_hwtcl disable
set_instance_parameter_value pcie_cv_hip_avmm_0 pldclk_hip_phase_shift_hwtcl {0 ps}
set_instance_parameter_value pcie_cv_hip_avmm_0 pll_refclk_freq_hwtcl {100 MHz}
set_instance_parameter_value pcie_cv_hip_avmm_0 port_link_number_hwtcl 1
set_instance_parameter_value pcie_cv_hip_avmm_0 port_type_hwtcl {Root port}
set_instance_parameter_value pcie_cv_hip_avmm_0 prefetchable_mem_window_addr_width_hwtcl 0
set_instance_parameter_value pcie_cv_hip_avmm_0 register_pipe_signals_advanced_default_hwtcl true
set_instance_parameter_value pcie_cv_hip_avmm_0 reserved_debug_advanced_default_hwtcl 0
set_instance_parameter_value pcie_cv_hip_avmm_0 retry_buffer_last_active_address_advanced_default_hwtcl 255
set_instance_parameter_value pcie_cv_hip_avmm_0 revision_id_hwtcl 1
set_instance_parameter_value pcie_cv_hip_avmm_0 rpre_emph_a_val_hwtcl 11
set_instance_parameter_value pcie_cv_hip_avmm_0 rpre_emph_b_val_hwtcl 0
set_instance_parameter_value pcie_cv_hip_avmm_0 rpre_emph_c_val_hwtcl 22
set_instance_parameter_value pcie_cv_hip_avmm_0 rpre_emph_d_val_hwtcl 12
set_instance_parameter_value pcie_cv_hip_avmm_0 rpre_emph_e_val_hwtcl 21
set_instance_parameter_value pcie_cv_hip_avmm_0 rvod_sel_a_val_hwtcl 50
set_instance_parameter_value pcie_cv_hip_avmm_0 rvod_sel_b_val_hwtcl 34
set_instance_parameter_value pcie_cv_hip_avmm_0 rvod_sel_c_val_hwtcl 50
set_instance_parameter_value pcie_cv_hip_avmm_0 rvod_sel_d_val_hwtcl 50
set_instance_parameter_value pcie_cv_hip_avmm_0 rvod_sel_e_val_hwtcl 9
set_instance_parameter_value pcie_cv_hip_avmm_0 rx_cdc_almost_full_advanced_default_hwtcl 12
set_instance_parameter_value pcie_cv_hip_avmm_0 rx_l0s_count_idl_advanced_default_hwtcl 0
set_instance_parameter_value pcie_cv_hip_avmm_0 rxbuffer_rxreq_hwtcl Balanced
set_instance_parameter_value pcie_cv_hip_avmm_0 sameclock_nfts_count_advanced_default_hwtcl 255
set_instance_parameter_value pcie_cv_hip_avmm_0 serial_sim_hwtcl 0
set_instance_parameter_value pcie_cv_hip_avmm_0 set_pld_clk_x1_625MHz_hwtcl 0
set_instance_parameter_value pcie_cv_hip_avmm_0 skp_os_gen3_count_hwtcl 0
set_instance_parameter_value pcie_cv_hip_avmm_0 skp_os_schedule_count_advanced_default_hwtcl 0
set_instance_parameter_value pcie_cv_hip_avmm_0 slot_number_hwtcl 0
set_instance_parameter_value pcie_cv_hip_avmm_0 slot_power_limit_hwtcl 0
set_instance_parameter_value pcie_cv_hip_avmm_0 slot_power_scale_hwtcl 0
set_instance_parameter_value pcie_cv_hip_avmm_0 slotclkcfg_hwtcl 1
set_instance_parameter_value pcie_cv_hip_avmm_0 ssid_hwtcl 0
set_instance_parameter_value pcie_cv_hip_avmm_0 ssvid_hwtcl 0
set_instance_parameter_value pcie_cv_hip_avmm_0 subsystem_device_id_hwtcl 57344
set_instance_parameter_value pcie_cv_hip_avmm_0 subsystem_vendor_id_hwtcl 4466
set_instance_parameter_value pcie_cv_hip_avmm_0 surprise_down_error_support_hwtcl 0
set_instance_parameter_value pcie_cv_hip_avmm_0 tph_completer_hwtcl false
set_instance_parameter_value pcie_cv_hip_avmm_0 tx_cdc_almost_empty_advanced_default_hwtcl 5
set_instance_parameter_value pcie_cv_hip_avmm_0 tx_cdc_almost_full_advanced_default_hwtcl 11
set_instance_parameter_value pcie_cv_hip_avmm_0 use_aer_hwtcl 0
set_instance_parameter_value pcie_cv_hip_avmm_0 use_ast_parity 0
set_instance_parameter_value pcie_cv_hip_avmm_0 use_crc_forwarding_hwtcl 0
set_instance_parameter_value pcie_cv_hip_avmm_0 use_rx_st_be_hwtcl 0
set_instance_parameter_value pcie_cv_hip_avmm_0 use_tl_cfg_sync_advanced_default_hwtcl 1
set_instance_parameter_value pcie_cv_hip_avmm_0 user_id_hwtcl 0
set_instance_parameter_value pcie_cv_hip_avmm_0 vc0_clk_enable_advanced_default_hwtcl true
set_instance_parameter_value pcie_cv_hip_avmm_0 vendor_id_hwtcl 4466
set_instance_parameter_value pcie_cv_hip_avmm_0 vsec_id_hwtcl 4466
set_instance_parameter_value pcie_cv_hip_avmm_0 vsec_rev_hwtcl 0
set_instance_parameter_value pcie_cv_hip_avmm_0 wrong_device_id_hwtcl disable

add_instance alt_xcvr_reconfig_0 alt_xcvr_reconfig 17.0
set_instance_parameter_value alt_xcvr_reconfig_0 device_family {Cyclone V}
set_instance_parameter_value alt_xcvr_reconfig_0 enable_adce 0
set_instance_parameter_value alt_xcvr_reconfig_0 enable_analog 1
set_instance_parameter_value alt_xcvr_reconfig_0 number_of_reconfig_interfaces 5

add_instance ccb_lw_74_to_125 altera_avalon_mm_clock_crossing_bridge 17.0
set_instance_parameter_value ccb_lw_74_to_125 ADDRESS_WIDTH 15
set_instance_parameter_value ccb_lw_74_to_125 COMMAND_FIFO_DEPTH 2
set_instance_parameter_value ccb_lw_74_to_125 DATA_WIDTH 32
set_instance_parameter_value ccb_lw_74_to_125 MASTER_SYNC_DEPTH 2
set_instance_parameter_value ccb_lw_74_to_125 MAX_BURST_SIZE 1
set_instance_parameter_value ccb_lw_74_to_125 RESPONSE_FIFO_DEPTH 2
set_instance_parameter_value ccb_lw_74_to_125 SLAVE_SYNC_DEPTH 2
set_instance_parameter_value ccb_lw_74_to_125 USE_AUTO_ADDRESS_WIDTH 0
